# Altium schematic sheet pa-5g.SchDoc
size Letter; CompanyName: Signal Laboratories, Inc.; Address1: 3479 Edison Way; Address2: Menlo Park CA 94025; Address3: +1 (877) 778-8435; Address4: siglabs.com; Revision: 1; SheetNumber: 1; SheetTotal: 1
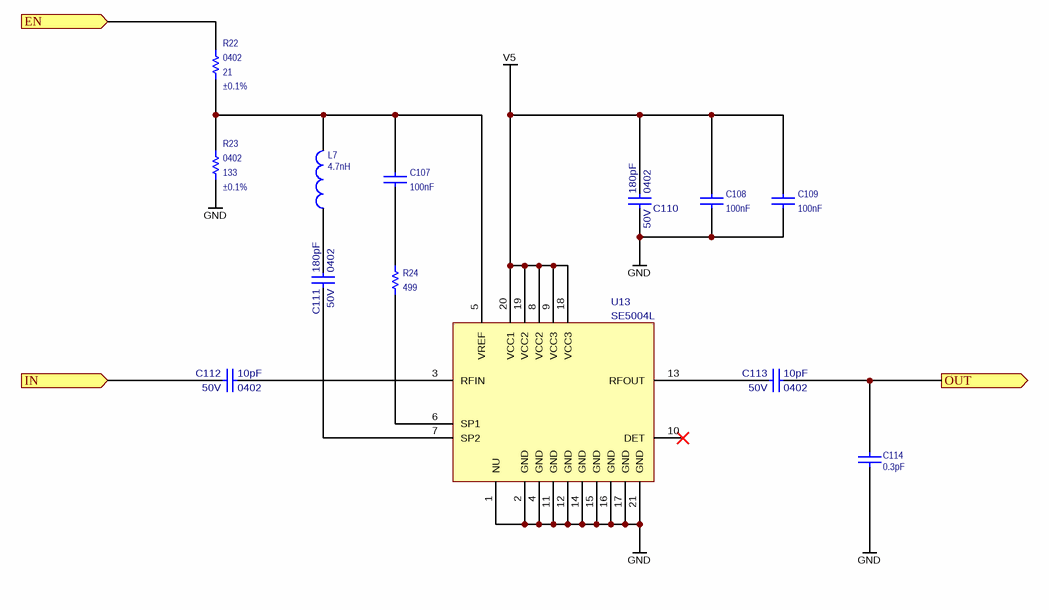
[diagram p0: pa-5g.SchDoc]

## Parts
C107  value 100nF  [CAPC100X50X55L25N]  (hidden comment: GRM155R71C104KA88J)
C108  value 100nF  [CAPC100X50X55L25N]  (hidden comment: GRM155R71C104KA88J)
C109  value 100nF  [CAPC100X50X55L25N]  (hidden comment: GRM155R71C104KA88J)
C110  value 180pF  Package: 0402  Voltage: 50V  [CAPC160X80X90L20N]  (hidden comment: VJ0402A181JNAAJ)
C111  value 180pF  Package: 0402  Voltage: 50V  [CAPC160X80X90L20N]  (hidden comment: VJ0402A181JNAAJ)
C112  value 10pF  Package: 0402  Voltage: 50V  [CAPC160X80X90L20N]  (hidden comment: VJ0402A100JXA)
C113  value 10pF  Package: 0402  Voltage: 50V  [CAPC160X80X90L20N]  (hidden comment: VJ0402A100JXA)
C114  value 0.3pF  [0402]  (hidden comment: CBR04C200F5GAC)
L7  value 4.7nH  [0402]  (hidden comment: LQW15AN4N7C00D)
R22  value 21  Tolerance: ±0.1%  Package: 0402  [RESC1005X40N]  (hidden comment: ERJ-2RKF21R0X)
R23  value 133  Tolerance: ±0.1%  Package: 0402  [RESC1005X40N]  (hidden comment: ERA-2AEB1330X)
R24  value 499  [RESC1005X40N]  (hidden comment: MCS0402PD4990DE500)
U13  SE5004L  [SE5004L]

## Ports
EN (in), IN (in), OUT (out)

## Nets
GND: C108.1 C109.1 C110.1 C114.1 R23.1 U13.1(NU) U13.2(GND) U13.4(GND) U13.11(GND) U13.12(GND) U13.14(GND) U13.15(GND) U13.16(GND) U13.17(GND) U13.21(GND)
V5: C108.2 C109.2 C110.2 U13.8(VCC2) U13.9(VCC3) U13.18(VCC3) U13.19(VCC2) U13.20(VCC1)
EN: R22.2 ; port EN
IN: C112.1 ; port IN
OUT: C113.2 C114.2 ; port OUT
NetC107_1: C107.1 R24.2
NetC107_2: C107.2 L7.2 R22.1 R23.2 U13.5(VREF)
NetC111_1: C111.1 U13.7(SP2)
NetC111_2: C111.2 L7.1
NetC112_2: C112.2 U13.3(RFIN)
NetC113_1: C113.1 U13.13(RFOUT)
NetR24_1: R24.1 U13.6(SP1)

Not connected (* = marked no-connect by the designer): U13 10(DET)*

## Notes on the sheet
- Title
- Engineer
- Revision
- Drawn By
- Checked By
- Date
- Sheet
- of

## Library data of the parts
C107-C109 = CAP 0402: Ceramic Capacitor 100nF ±10% 16V X7R 0402; Manufacturer: Murata; Tr: -55:125; Voltage: 16V; Manufacturer P/N: GRM155R71C104KA88J; Package: 0402; Tolerance: ±10%
C110 C111 = VJ0402A100JXA: Ceramic Capacitor 180pF ±5% 50V C0G 0402; Manufacturer: Vishay; Tr: -55:150; pF: 180; Manufacturer P/N: VJ0402A181JNAAJ; Tolerance: ±5%
C112 C113 = VJ0402A100JXA: Ceramic Capacitor 10pF ±5% 50V C0G 0402; Manufacturer: Vishay; Tr: -55:150; pF: 10; Manufacturer P/N: VJ0402A100JXA; Tolerance: ±5%
C114 = CAP 0402: Ceramic Capacitor 20pF ±1% 50V NP0 0402; Manufacturer: Kemet; Manufacturer P/N: CBR04C308B5GAC; Tr: -55:125; Voltage: 50V; Package: 0402; Tolerance: ±1%
L7 = INDUCTOR: Inductor Wirewound 4.7nH ±0.2nH 0402; Manufacturer: Murata; Tr: -55:125; Manufacturer P/N: LQW15AN4N7C00D; Package: 0402; Tolerance: ±0.2nH
R22 = RES: Thin Film Resistor 21 +/-0.1% SMD 0402; Manufacturer: Panasoinc; Tr: -55:155; Power: 0.063W; Tcr: *; Manufacturer P/N: ERJ-2RKF21R0X; Alternatives: *; Voltage: *
R23 = RES: Thin Film Resistor 133 +/-0.1% SMD 0402; Manufacturer: Panasoinc; Tr: -55:155; Power: 0.063W; Tcr: *; Manufacturer P/N: ERA-2AEB1330X; Alternatives: *; Voltage: *
R24 = RES 0603: Thin Film Resistor 499 Ohm ±0.5% 0402; Manufacturer: Vishay; Tr: -55:175; Package: 0402; Manufacturer P/N: MCS0402PD4990DE500; Do Not Place: *; Tolerance: ±0.5%
U13 = SE5004L: 5 GHz, 26dBm Power Amplifier